# EAGLE design sensor_node (EAGLE 8.7.1)
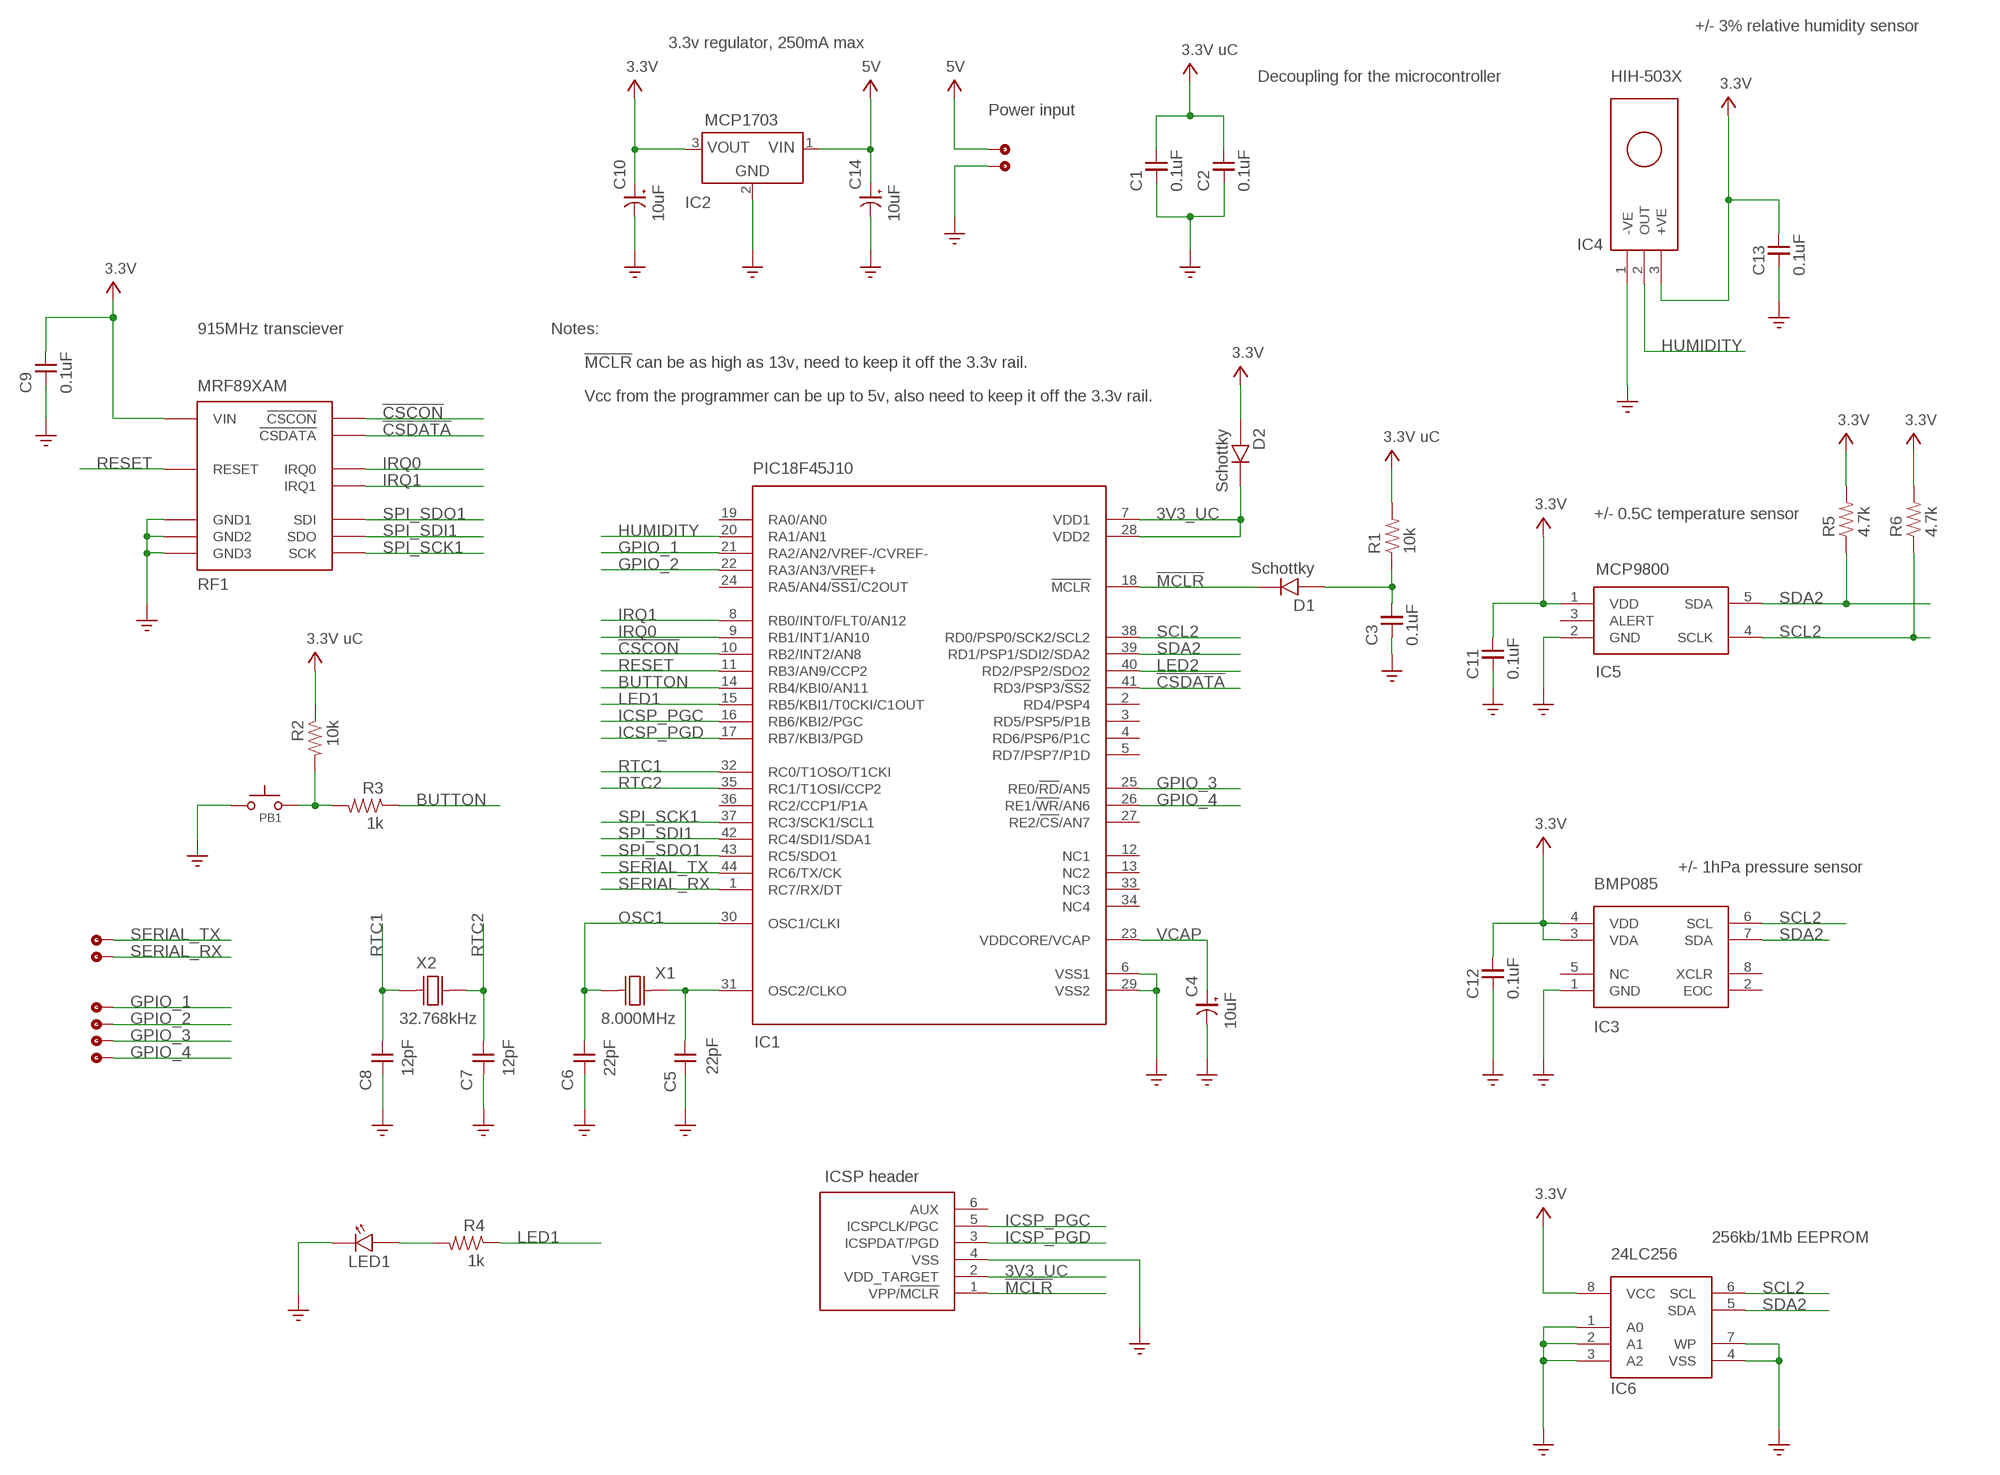
[diagram p0: schematic, sheet 1]

## Parts
C1  0.1uF  CAPACITOR0805  [0805]
C2  0.1uF  CAPACITOR0805  [0805]
C3  0.1uF  CAPACITOR0805  [0805]
C4  10uF  CAPACITOR+  [1206]
C5  22pF  CAPACITOR0805  [0805]
C6  22pF  CAPACITOR0805  [0805]
C7  12pF  CAPACITOR0805  [0805]
C8  12pF  CAPACITOR0805  [0805]
C9  0.1uF  CAPACITOR0805  [0805]
C10  10uF  CAPACITOR+  [1206]
C11  0.1uF  CAPACITOR0805  [0805]
C12  0.1uF  CAPACITOR0805  [0805]
C13  0.1uF  CAPACITOR0805  [0805]
C14  10uF  CAPACITOR+  [1206]
CONN1  ICSP header  ICSP_HEADER_2X6  [ISP_HEADER]
D1  Schottky  DIODE0805  [0805]
D2  Schottky  DIODE0805  [0805]
IC1  PIC18F45J10  [TQFP_44]
IC2  MCP1703  [SOT-23A]
IC3  BMP085  [LCC8]
IC4  HIH-503X  [HIH_503X]
IC5  MCP9800  [SOT_23-5]
IC6  24LC256  MCP24LC256_SOIC  [SO_8]
LED1  LED0805  [0805]
PB1  BUTTON_2PADS  [BUTTON_4SMD]
R1  10k  RESISTORSMD0805  [0805]
R2  10k  RESISTORSMD0805  [0805]
R3  1k  RESISTORSMD0805  [0805]
R4  1k  RESISTORSMD0805  [0805]
R5  4.7k  RESISTORSMD0805  [0805]
R6  4.7k  RESISTORSMD0805  [0805]
RF1  MRF89XAM  [MRF89XAM]
TP1  TP  [TP]
TP2  TP  [TP]
TP3  TP  [TP]
TP4  TP  [TP]
TP5  TP  [TP]
TP6  TP  [TP]
TP7  TP  [TP]
TP8  TP  [TP]
X1  8.000MHz  CRYSTALNX5032  [NX5032]
X2  32.768kHz  CRYSTAL  [CM200C]

## Nets
3V3: C9.2 C10.1 C11.2 C12.2 C13.2 D2.1(A) IC2.3(VOUT) IC3.3(VDA) IC3.4(VDD) IC4.3(+VE) IC5.1(VDD) IC6.8(VCC) R5.2 R6.2 RF1.VIN ; supply symbol labelled 3.3V
3V3_UC: C1.2 C2.2 CONN1.2(VDD_TARGET) D2.2(K) IC1.7(VDD1) IC1.28(VDD2) R1.2 R2.1 ; supply symbol labelled 3.3V uC
5V: C14.1 IC2.1(VIN) TP3.P$1
!CSCON!: IC1.10(RB2/INT2/AN8) RF1.!CSCON
!CSDATA!: IC1.41(RD3/PSP3/!SS2!) RF1.!CSDATA
!MCLR!: CONN1.1(VPP/!MCLR!) D1.2(K) IC1.18(!MCLR!)
BUTTON: IC1.14(RB4/KBI0/AN11) R3.1
GND: C1.1 C2.1 C3.1 C4.2 C5.2 C6.2 C7.2 C8.2 C9.1 C10.2 C11.1 C12.1 C13.1 C14.2 CONN1.4(VSS) IC1.6(VSS1) IC1.29(VSS2) IC2.2(GND) IC3.1(GND) IC4.1(-VE) IC5.2(GND) IC6.1(A0) IC6.2(A1) IC6.3(A2) IC6.4(VSS) IC6.7(WP) LED1.2(K) PB1.3 RF1.GND1 RF1.GND2 RF1.GND3 TP4.P$1 ; supply symbol labelled DGND
GPIO_1: IC1.21(RA2/AN2/VREF-/CVREF-) TP6.P$1
GPIO_2: IC1.22(RA3/AN3/VREF+) TP5.P$1
GPIO_3: IC1.25(RE0/!RD!/AN5) TP7.P$1
GPIO_4: IC1.26(RE1/!WR!/AN6) TP8.P$1
HUMIDITY: IC1.20(RA1/AN1) IC4.2(OUT)
ICSP_PGC: CONN1.5(ICSPCLK/PGC) IC1.16(RB6/KBI2/PGC)
ICSP_PGD: CONN1.3(ICSPDAT/PGD) IC1.17(RB7/KBI3/PGD)
IRQ0: IC1.9(RB1/INT1/AN10) RF1.IRQ0
IRQ1: IC1.8(RB0/INT0/FLT0/AN12) RF1.IRQ1
LED1: IC1.15(RB5/KBI1/T0CKI/C1OUT) R4.1
LED2: IC1.40(RD2/PSP2/SDO2)
N$1: LED1.1(A) R4.2
N$2: C3.2 D1.1(A) R1.1
N$3: PB1.1 R2.2 R3.2
OSC1: C6.1 IC1.30(OSC1/CLKI) X1.P$1
OSC2: C5.1 IC1.31(OSC2/CLKO) X1.P$2
RESET: IC1.11(RB3/AN9/CCP2) RF1.RESET
RTC1: C8.1 IC1.32(RC0/T1OSO/T1CKI) X2.OSC2
RTC2: C7.1 IC1.35(RC1/T1OSI/CCP2) X2.OSC1
SCL2: IC1.38(RD0/PSP0/SCK2/SCL2) IC3.6(SCL) IC5.4(SCLK) IC6.6(SCL) R6.1
SDA2: IC1.39(RD1/PSP1/SDI2/SDA2) IC3.7(SDA) IC5.5(SDA) IC6.5(SDA) R5.1
SERIAL_RX: IC1.1(RC7/RX/DT) TP2.P$1
SERIAL_TX: IC1.44(RC6/TX/CK) TP1.P$1
SPI_SCK1: IC1.37(RC3/SCK1/SCL1) RF1.SCK
SPI_SDI1: IC1.42(RC4/SDI1/SDA1) RF1.SDO
SPI_SDO1: IC1.43(RC5/SDO1) RF1.SDI
VCAP: C4.1 IC1.23(VDDCORE/VCAP)
Unconnected: CONN1.6(AUX) IC1.2(RD4/PSP4) IC1.3(RD5/PSP5/P1B) IC1.4(RD6/PSP6/P1C) IC1.5(RD7/PSP7/P1D) IC1.12(NC1) IC1.13(NC2) IC1.19(RA0/AN0) IC1.24(RA5/AN4/!SS1!/C2OUT) IC1.27(RE2/!CS!/AN7) IC1.33(NC3) IC1.34(NC4) IC1.36(RC2/CCP1/P1A) IC3.2(EOC) IC3.5(NC) IC3.8(XCLR) IC5.3(ALERT)

## Notes on the sheet
- +/- 3% relative humidity sensor
- 3.3v regulator, 250mA max
- Decoupling for the microcontroller
- Power input
- 915MHz transciever | Notes:
- !MCLR! can be as high as 13v, need to keep it off the 3.3v rail.
- Vcc from the programmer can be up to 5v, also need to keep it off the 3.3v rail.
- +/- 0.5C temperature sensor
- +/- 1hPa pressure sensor
- 256kb/1Mb EEPROM

## Library data of the parts
C1-C3 C5-C9 C11-C13 = thomas:CAPACITOR: This is a capacitor
C4 = thomas_july_29_2013:CAPACITOR+: This is a polarized capacitor
C10 C14 = thomas:CAPACITOR+: This is a polarized capacitor
CONN1 = thomas:ICSP_HEADER: This is a connector for the PICkit 2 ICSP
D1 D2 = thomas:DIODE: This is a diode
IC1 = thomas:PIC18F45J10: The PIC18F45J10 is an 8-bit PIC microcontroller with PICkit2-compatible ICSP, one EUSART and two MSSP ports, and a secondary RTC oscillator in addition to the main oscillator.
IC2 = thomas:MCP1703: The MCP1703 is a LDO regulator from Microchip
IC3 = thomas:BMP085: The BMP085 is an I2C barometric pressure sensor
IC4 = thomas:HIH-503X: The HIH-503x is an analog humidity sensor from Honeywell
IC5 = thomas_july_26_2013:MCP9800: The MCP9800 is an I2C temperature sensor from Microchip
IC6 = thomas:MCP24LC256: The MCP24LC256 is an I2C 256kbit EEPROM from Microchip.
LED1 = thomas:LED: This is a Light-Emitting Diode
PB1 = thomas:BUTTON: This is a momentary pushbutton switch
R1-R6 = thomas:RESISTOR: This is a resistor
RF1 = thomas:MRF89XAM: The MRF89XAM are 868MHz and 915MHz transciever modules from Microchip, based on the MRF89XA transciever IC, which include an integrated antenna and FCC certification.
TP1-TP8 = thomas:TP: A test point
X1 X2 = thomas:CRYSTAL: This is a quartz crystal

## Board
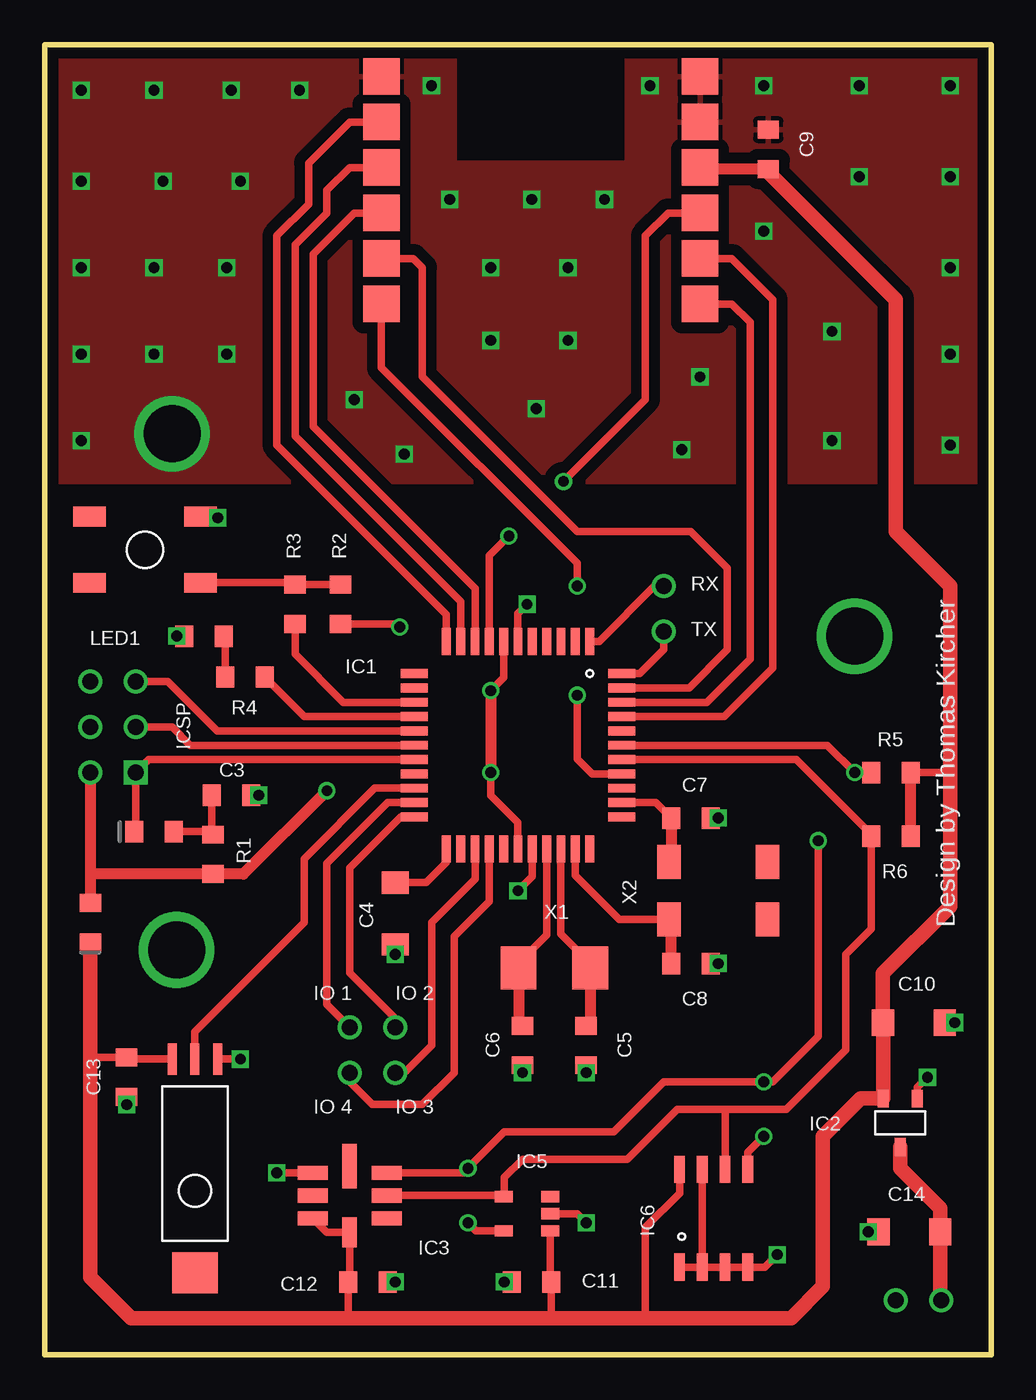
[diagram p1: board, top side]
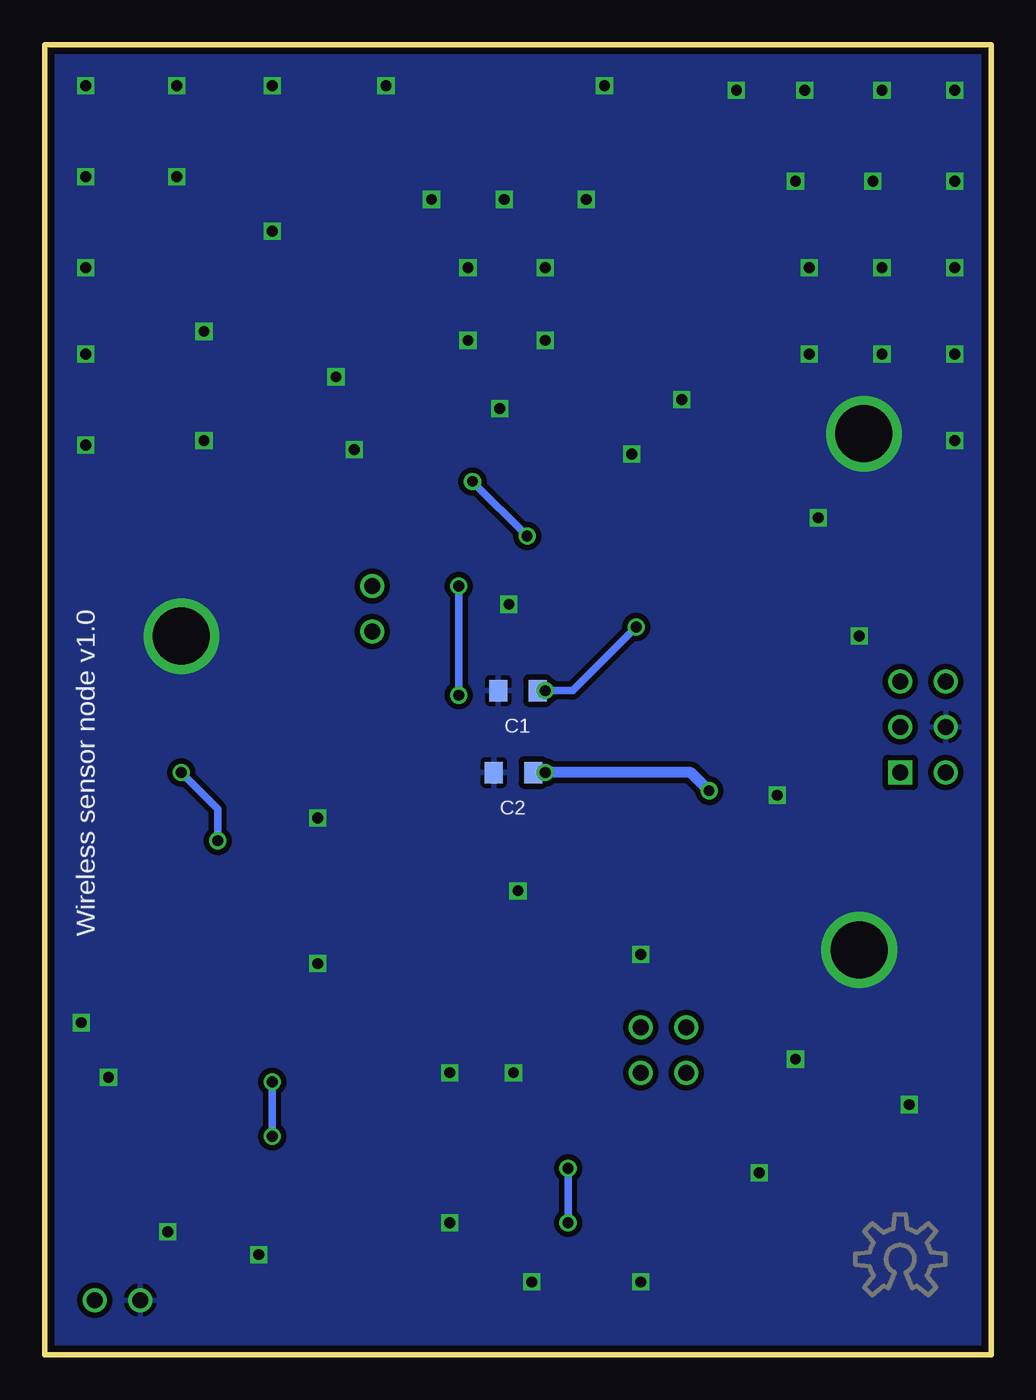
[diagram p2: board, bottom side, seen from below]

Size 52.83 x 73.15 mm. Coordinates in mm from the lower left corner, seen from the top.
Outline: 0,73.15 52.83,73.15 52.83,0 0,0 0,73.15
Copper layers (1*16): Top 0.0356mm / dielectric 1.5011mm / Bottom 0.0356mm
Design rules "LaenPCBOrder": minimum track width 6mil, minimum drill 13mil, track to track 6mil, track to pad 6mil, pad to pad 6mil, via to via 6mil, smd to smd 6mil, copper to edge 15mil, drill to drill 6mil, minimum pad ring 7mil, minimum via ring 7mil, stop-mask expansion 4mil, vias tented up to drill 0mil, thermal gap 10mil

### Footprints (pad centres in the part's own frame; a part is rotated, then mirrored left to right if it is on the bottom)
0805 = smd 1 x 1.2: 1 -1.1,0; 2 1.1,0
1206 = smd 1.25 x 1.5: 1 -1.725,0; 2 1.725,0
ISP_HEADER = drill 0.9 square: 1 -2.54,-1.27 | drill 0.9: 2 -2.54,1.27; 3 0,-1.27; 4 0,1.27; 5 2.54,-1.27; 6 2.54,1.27
TQFP_44 = smd 1.5 x 0.5: 1 -5.8,4; 2 -5.8,3.2; 3 -5.8,2.4; 4 -5.8,1.6; 5 -5.8,0.8; 6 -5.8,0; 7 -5.8,-0.8; 8 -5.8,-1.6; 9 -5.8,-2.4; 10 -5.8,-3.2; 11 -5.8,-4; 23 5.8,-4; 24 5.8,-3.2; 25 5.8,-2.4; 26 5.8,-1.6; 27 5.8,-0.8; 28 5.8,0; 29 5.8,0.8; 30 5.8,1.6; 31 5.8,2.4; 32 5.8,3.2; 33 5.8,4 | smd 0.5 x 1.5: 12 -4,-5.8; 13 -3.2,-5.8; 14 -2.4,-5.8; 15 -1.6,-5.8; 16 -0.8,-5.8; 17 0,-5.8; 18 0.8,-5.8; 19 1.6,-5.8; 20 2.4,-5.8; 21 3.2,-5.8; 22 4,-5.8; 34 4,5.8; 35 3.2,5.8; 36 2.4,5.8; 37 1.6,5.8; 38 0.8,5.8; 39 0,5.8; 40 -0.8,5.8; 41 -1.6,5.8; 42 -2.4,5.8; 43 -3.2,5.8; 44 -4,5.8
SOT-23A = smd 0.6 x 1: 1 0,1.35; 2 -0.95,-1.35; 3 0.95,-1.35
LCC8 = smd 1.67 x 0.8: 1 -2.065,1.27; 2 -2.065,0; 3 -2.065,-1.27; 5 2.065,-1.27; 6 2.065,0; 7 2.065,1.27 | smd 0.8 x 1.67: 4 0,-2.065 | smd 0.8 x 2.5: 8 0,1.65
HIH_503X = smd 0.508 x 1.778: 1 -1.27,-5.334; 2 0,-5.334; 3 1.27,-5.334 | smd 2.54 x 2.286: NC 0,6.604
SOT_23-5 = smd 0.635 x 1.016: 1 -0.953,-1.295; 2 0,-1.295; 3 0.953,-1.295; 4 0.953,1.295; 5 -0.953,1.295
SO_8 = smd 1.524 x 0.61: 1 -2.731,1.905; 2 -2.731,0.635; 3 -2.731,-0.635; 4 -2.731,-1.905; 5 2.731,-1.905; 6 2.731,-0.635; 7 2.731,0.635; 8 2.731,1.905
BUTTON_4SMD = smd 1.803 x 1.1: 1 -3.1,1.85; 2 3.1,1.85; 3 -3.1,-1.85; 4 3.1,-1.85
MRF89XAM = smd 2.032 x 2.032: !CSCON -8.89,1.27; !CSDATA 8.89,-3.81; GND1 -8.89,6.35; GND2 8.89,6.35; GND3 8.89,3.81; IRQ0 -8.89,-1.27; IRQ1 8.89,-1.27; RESET -8.89,3.81; SCK -8.89,-6.35; SDI -8.89,-3.81; SDO 8.89,-6.35; VIN 8.89,1.27
TP = drill 0.9: P$1 0,0
NX5032 = smd 2 x 2.4: P$1 2,0; P$2 -2,0
CM200C = smd 1.3 x 1.9: NC1 2.75,1.6; NC2 2.75,-1.6; OSC1 -2.75,1.6; OSC2 -2.75,-1.6

### Placement (x,y rotation side)
C1  26.42,37.08 0 bottom
C2  26.67,32.51 0 bottom
C3  10.41,31.24 180 top
C4  19.56,24.64 270 top
C5  30.23,17.27 270 top
C6  26.67,17.27 270 top
C7  36.07,29.97 0 top
C8  36.07,21.84 0 top
C9  40.39,67.31 270 top
C10  48.51,18.54 0 top
C11  27.18,4.06 0 top
C12  18.03,4.06 180 top
C13  4.57,15.49 90 top
C14  48.26,6.86 180 top
CONN1  3.81,35.05 90 top
D1  6.1,29.21 180 top
D2  2.54,24.13 90 top
IC1  26.42,34.04 270 top
IC2  47.75,12.95 180 top
IC3  17.02,8.89 0 top
IC4  8.38,11.18 180 top
IC5  26.92,7.87 90 top
IC6  37.34,7.62 90 top
LED1  8.89,40.13 180 top
OSHLOGO  [OSHLOGO]  5.08,5.33 0 bottom
PB1  5.59,44.96 180 top
R1  9.4,27.94 270 top
R2  16.51,41.91 90 top
R3  13.97,41.91 90 top
R4  11.18,37.85 180 top
R5  47.24,32.51 0 top
R6  47.24,28.96 0 top
RF1  27.69,65.02 0 top
TP1  34.54,40.39 0 top
TP2  34.54,42.93 0 top
TP3  50.04,3.05 270 top
TP4  47.5,3.05 270 top
TP5  19.56,18.29 0 top
TP6  17.02,18.29 0 top
TP7  19.56,15.75 0 top
TP8  17.02,15.75 0 top
X1  28.45,21.59 180 top
X2  37.59,25.91 0 top

### Tracks (layer width: path | path; a pad name or v marks a point on that pad's centre or on a via)
3V3
  Top 0.406: 28.24,6.94 IC5.1 28.22,4.38 C11.2 28.28,2.2 28.96,2.03 | 14.82,7.48 IC3.3 15.75,6.83 IC3.4 17.02,4.15 C12.2 16.93,2.12 17.02,2.03 | R5.2 50.55,32.51 | 39.56,2.1 37.59,2.03 | 35.27,2.07 35.31,2.03 | 33.78,2.03 33.53,2.29 33.53,7.11 35.43,9.02 IC6.8 | IC4.3 4.66,16.51 C13.2 2.71,16.59 2.54,16.76
  Top 0.61: RF1.VIN 36.66,66.21 C9.2 40.39,66.1 | R6.2 R5.2
  Top 0.813: 40.39,66.1 40.39,66.04 47.5,58.93 47.5,45.97 50.55,42.93 50.55,32.51 50.55,25.04 46.79,21.28 C10.1 46.8,18.28 IC2.3 45.55,14.3 43.43,12.19 43.43,3.81 41.66,2.03 37.59,2.03 35.31,2.03 33.78,2.03 28.96,2.03 17.02,2.03 4.83,2.03 2.54,4.32 2.54,16.76 D2.1
3V3_UC  (via drill 0.6)
  Top 0.406: v24.89,32.51 24.89,31.24 26.42,29.72 IC1.28 | v24.89,37.08 25.62,37.81 IC1.7 | R2.1 19.64,40.81 v19.81,40.64
  Top 0.61: v24.89,37.08 v24.89,32.51 | v15.75,31.5 11.09,26.84 R1.2 2.54,26.84 | CONN1.2 2.54,26.84 | D2.2 2.54,26.67 2.54,26.84
  Bottom 0.406: v19.81,40.64 23.37,37.08 v24.89,37.08 C1.2 | v24.89,32.51 C2.2
  Bottom 0.61: v15.75,31.5 16.76,32.51 v24.89,32.51
5V
  Top 0.813: IC2.1 47.75,10.41 49.98,8.18 C14.1 49.98,3.1 TP3.P$1
!CSCON!
  Top 0.406: RF1.!CSCON 17.02,66.29 15.75,65.02 15.75,63.75 13.97,61.98 13.97,51.31 23.22,42.06 IC1.10
!CSDATA!
  Top 0.406: RF1.!CSDATA 38.35,61.21 40.64,58.93 40.64,38.35 37.92,35.64 IC1.41
!MCLR!
  Top 0.406: D1.2 5.08,29.29 CONN1.1 5.8,33.24 IC1.18
BUTTON
  Top 0.406: IC1.14 16.65,36.44 13.97,39.12 R3.1
GND  (via drill 0.6, 3.2)
  Top 0.406: LED1.2 v7.37,40.13 | IC1.6 26.42,41.4 v26.92,41.91 | C12.1 v19.56,4.06 | C11.1 v25.65,4.06 | IC3.1 v12.95,10.16 | C13.1 v4.57,13.97 | IC5.2 29.72,7.87 v30.23,7.37 | C10.2 v50.8,18.54 | v45.97,6.86 C14.2 | C4.2 v19.56,22.35 | IC2.2 48.7,14.92 v49.28,15.49 | IC6.1 IC6.2 | IC6.2 IC6.3 IC6.4 | IC6.2 40.2,4.89 v40.89,5.59 | IC6.2 IC6.7 | IC1.29 27.22,26.71 v26.42,25.91 | C6.2 v26.67,15.75 | C5.2 v30.23,15.75 | C8.2 v37.59,21.84 | C7.2 v37.59,29.97 | C3.1 v11.94,31.24 | IC4.1 v10.92,16.51 | PB1.3 9.58,47.06 v9.65,46.74
  other vias: 43.94,57.15 50.55,55.88 2.03,70.61 17.27,53.34 10.41,70.61 40.13,70.87 36.58,54.61 6.6,65.53 10.92,65.53 6.1,70.61 45.47,70.87 50.55,65.79 24.89,60.71 22.61,64.52 14.22,70.61 2.03,65.53 7.11,51.43 31.24,64.52 45.47,65.79 29.21,60.71 10.16,60.71 10.16,55.88 50.55,70.87 33.78,70.87 40.13,62.74 24.89,56.64 50.55,60.71 50.55,50.8 6.1,60.71 45.21,40.13 2.03,60.71 2.03,55.88 6.1,55.88 21.59,70.87 27.18,64.52 2.03,51.05 20.07,50.29 43.94,51.05 29.21,56.64 27.43,52.83 35.56,50.55 7.37,22.61
  pour Bottom (isolate 0.305): 0,73.15 0,0 52.83,0.25 52.83,73.41
  pour Top (isolate 0.61): 0,73.15 22.86,73.15 22.86,66.55 32.51,66.55 32.51,73.15 52.83,73.15 52.83,48.77 0,48.77
GPIO_1
  Top 0.406: IC1.21 19.15,30.84 15.75,27.43 15.75,19.56 TP6.P$1
GPIO_2
  Top 0.406: IC1.22 19.88,30.04 17.02,27.18 17.02,21.34 19.56,18.8 TP5.P$1
GPIO_3
  Top 0.406: IC1.25 24.02,26.56 21.59,24.13 21.59,17.27 20.07,15.75 TP7.P$1
GPIO_4
  Top 0.406: IC1.26 24.82,25.32 22.86,23.37 22.86,15.75 21.08,13.97 18.29,13.97 17.02,15.24 TP8.P$1
HUMIDITY
  Top 0.406: IC4.2 8.38,18.03 14.48,24.13 14.48,27.69 18.43,31.64 IC1.20
ICSP_PGC
  Top 0.406: IC1.16 9.61,34.84 6.86,37.59 CONN1.5
ICSP_PGD
  Top 0.406: IC1.17 8.13,34.04 7.11,35.05 CONN1.3
IRQ0
  Top 0.406: IC1.9 24.02,42.79 14.99,51.82 14.99,61.47 17.27,63.75 RF1.IRQ0
IRQ1  (via drill 0.6)
  Top 0.406: RF1.IRQ1 34.8,63.75 33.53,62.48 33.53,53.34 v28.96,48.77 | IC1.8 24.82,44.63 v25.91,45.72
  Bottom 0.406: v25.91,45.72 v28.96,48.77
LED1
  Top 0.406: IC1.15 14.49,35.64 R4.1
N$1
  Top 0.406: R4.2 10.08,40.05 LED1.1
N$2
  Top 0.406: C3.2 9.31,29.21 R1.1 8.97,29.21 D1.1
N$3
  Top 0.406: R2.2 R3.2 13.87,43.11 PB1.1
OSC1
  Top 0.406: IC1.30 28.02,23.44 26.45,21.88 X1.P$1
  Top 0.61: X1.P$1 26.45,18.49 C6.1
OSC2
  Top 0.406: IC1.31 28.82,23.51 30.45,21.88 X1.P$2
  Top 0.61: X1.P$2 30.45,18.49 C5.1
RESET
  Top 0.406: RF1.RESET 17.02,68.83 14.73,66.55 14.73,64.26 12.95,62.48 12.95,50.8 22.42,41.34 IC1.11
RTC1
  Top 0.406: IC1.32 29.62,26.77 32.08,24.31 X2.OSC2 34.97,23.93
  Top 0.61: C8.1 34.97,23.93
RTC2
  Top 0.406: IC1.35 34.1,30.84 C7.1
  Top 0.61: C7.1 34.97,27.89 X2.OSC1
SCL2
  Top 0.406: IC3.6 25.57,8.89 IC5.4 25.65,8.85 25.65,9.91 26.67,10.92 32.51,10.92 35.31,13.72 37.85,13.72 | IC1.38 41.95,33.24 46.14,29.04 R6.1 46.14,23.79 44.7,22.35 44.7,17.02 41.4,13.72 37.85,13.72 | IC6.6 37.97,13.59 37.85,13.72
SDA2  (via drill 0.6)
  Top 0.406: IC1.39 43.69,34.04 v45.21,32.51 R5.1 | IC5.5 24.07,6.92 v23.62,7.37 | IC3.7 23.37,10.16 v23.62,10.41 25.65,12.45 31.75,12.45 34.54,15.24 v40.13,15.24 40.64,15.24 43.18,17.78 v43.18,28.7 | IC6.5 39.24,11.3 v40.13,12.19
  Bottom 0.406: v23.62,7.37 v23.62,10.41 | v43.18,28.7 43.18,30.48 v45.21,32.51 | v40.13,12.19 v40.13,15.24
SERIAL_RX
  Top 0.406: IC1.1 30.95,39.84 34.04,42.93 TP2.P$1
SERIAL_TX
  Top 0.406: IC1.44 33.21,38.04 34.54,39.37 TP1.P$1
SPI_SCK1  (via drill 0.6)
  Top 0.406: RF1.SCK 18.8,55.12 29.72,44.2 v29.72,42.93 | IC1.37 30.56,32.44 29.72,33.27 v29.72,36.83
  Bottom 0.406: v29.72,42.93 v29.72,36.83
SPI_SDI1
  Top 0.406: RF1.SDO 38.35,58.67 39.37,57.66 39.37,38.86 36.94,36.44 IC1.42
SPI_SDO1
  Top 0.406: IC1.43 35.97,37.24 38.1,39.37 38.1,43.94 36.07,45.97 29.72,45.97 21.08,54.61 21.08,60.71 20.57,61.21 RF1.SDI
VCAP
  Top 0.406: IC1.23 22.42,27.5 21.28,26.36 C4.1

### Text on the board
tNames: RX | TX | ICSP | Design by Thomas Kircher | IO 1 | IO 2 | IO 4 | IO 3 | IC3
bNames: Wireless sensor node v1.0